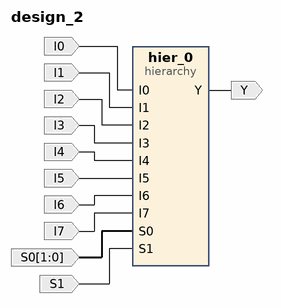
[diagram p0: block diagram of the top level]
# Vivado block design design_2, xc7z010clg400-1, Vivado 2023.2.2
create_bd_design design_2

create_bd_port -dir I I0
create_bd_port -dir I I1
create_bd_port -dir I I2
create_bd_port -dir I I3
create_bd_port -dir I I4
create_bd_port -dir I I5
create_bd_port -dir I I6
create_bd_port -dir I I7
create_bd_port -dir I -from 1 -to 0 S0
create_bd_port -dir I S1
create_bd_port -dir O Y

create_bd_cell -type hier hier_0

# ---- hierarchy /hier_0 ----
current_bd_instance /hier_0
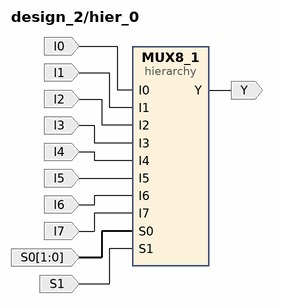
[diagram p1: block diagram inside /hier_0]
create_bd_pin -dir I I7
create_bd_pin -dir I I6
create_bd_pin -dir I I5
create_bd_pin -dir I I4
create_bd_pin -dir I -from 1 -to 0 S0
create_bd_pin -dir I I3
create_bd_pin -dir I I2
create_bd_pin -dir I I1
create_bd_pin -dir I I0
create_bd_pin -dir I S1
create_bd_pin -dir O Y

create_bd_cell -type hier MUX8_1

# ---- hierarchy /hier_0/MUX8_1 ----
current_bd_instance /hier_0/MUX8_1
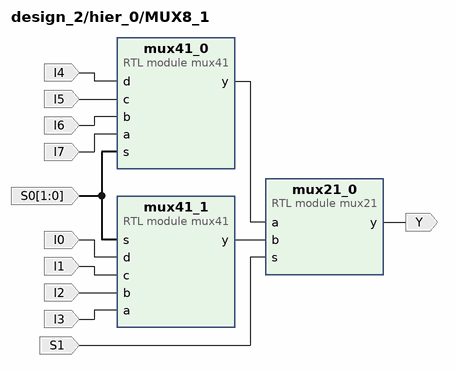
[diagram p2: block diagram inside /hier_0/MUX8_1]
create_bd_pin -dir I I7
create_bd_pin -dir I I6
create_bd_pin -dir I I5
create_bd_pin -dir I I4
create_bd_pin -dir I -from 1 -to 0 S0
create_bd_pin -dir I I3
create_bd_pin -dir I I2
create_bd_pin -dir I I1
create_bd_pin -dir I I0
create_bd_pin -dir I S1
create_bd_pin -dir O Y

create_bd_cell -type module -reference mux41 mux41_0
create_bd_cell -type module -reference mux41 mux41_1
create_bd_cell -type module -reference mux21 mux21_0

# ---- connections ----

current_bd_instance /hier_0
connect_bd_net -net I0_1 [get_bd_pins I0] [get_bd_pins MUX8_1/I0]
connect_bd_net -net I1_1 [get_bd_pins I1] [get_bd_pins MUX8_1/I1]
connect_bd_net -net I2_1 [get_bd_pins I2] [get_bd_pins MUX8_1/I2]
connect_bd_net -net I3_1 [get_bd_pins I3] [get_bd_pins MUX8_1/I3]
connect_bd_net -net I4_1 [get_bd_pins I4] [get_bd_pins MUX8_1/I4]
connect_bd_net -net I5_1 [get_bd_pins I5] [get_bd_pins MUX8_1/I5]
connect_bd_net -net I6_1 [get_bd_pins I6] [get_bd_pins MUX8_1/I6]
connect_bd_net -net I7_1 [get_bd_pins I7] [get_bd_pins MUX8_1/I7]
connect_bd_net -net S0_1 [get_bd_pins S0] [get_bd_pins MUX8_1/S0]
connect_bd_net -net S1_1 [get_bd_pins S1] [get_bd_pins MUX8_1/S1]
connect_bd_net -net mux21_0_y [get_bd_pins MUX8_1/Y] [get_bd_pins Y]

current_bd_instance /hier_0/MUX8_1
connect_bd_net -net I0_1 [get_bd_pins I0] [get_bd_pins mux41_1/d]
connect_bd_net -net I1_1 [get_bd_pins I1] [get_bd_pins mux41_1/c]
connect_bd_net -net I2_1 [get_bd_pins I2] [get_bd_pins mux41_1/b]
connect_bd_net -net I3_1 [get_bd_pins I3] [get_bd_pins mux41_1/a]
connect_bd_net -net I4_1 [get_bd_pins I4] [get_bd_pins mux41_0/d]
connect_bd_net -net I5_1 [get_bd_pins I5] [get_bd_pins mux41_0/c]
connect_bd_net -net I6_1 [get_bd_pins I6] [get_bd_pins mux41_0/b]
connect_bd_net -net I7_1 [get_bd_pins I7] [get_bd_pins mux41_0/a]
connect_bd_net -net S0_1 [get_bd_pins S0] [get_bd_pins mux41_1/s] [get_bd_pins mux41_0/s]
connect_bd_net -net S1_1 [get_bd_pins S1] [get_bd_pins mux21_0/s]
connect_bd_net [get_bd_pins mux21_0/y] [get_bd_pins Y]
connect_bd_net [get_bd_pins mux41_0/y] [get_bd_pins mux21_0/a]
connect_bd_net [get_bd_pins mux41_1/y] [get_bd_pins mux21_0/b]

current_bd_instance /
connect_bd_net -net I0_1 [get_bd_ports I0] [get_bd_pins hier_0/I0]
connect_bd_net -net I1_1 [get_bd_ports I1] [get_bd_pins hier_0/I1]
connect_bd_net -net I2_1 [get_bd_ports I2] [get_bd_pins hier_0/I2]
connect_bd_net -net I3_1 [get_bd_ports I3] [get_bd_pins hier_0/I3]
connect_bd_net -net I4_1 [get_bd_ports I4] [get_bd_pins hier_0/I4]
connect_bd_net -net I5_1 [get_bd_ports I5] [get_bd_pins hier_0/I5]
connect_bd_net -net I6_1 [get_bd_ports I6] [get_bd_pins hier_0/I6]
connect_bd_net -net I7_1 [get_bd_ports I7] [get_bd_pins hier_0/I7]
connect_bd_net -net S0_1 [get_bd_ports S0] [get_bd_pins hier_0/S0]
connect_bd_net -net S1_1 [get_bd_ports S1] [get_bd_pins hier_0/S1]
connect_bd_net -net mux21_0_y [get_bd_pins hier_0/Y] [get_bd_ports Y]

validate_bd_design
save_bd_design
